# Altium schematic sheet HS-IO-Top.SchDoc
size A3; SheetNumber: 1; SheetTotal: 1
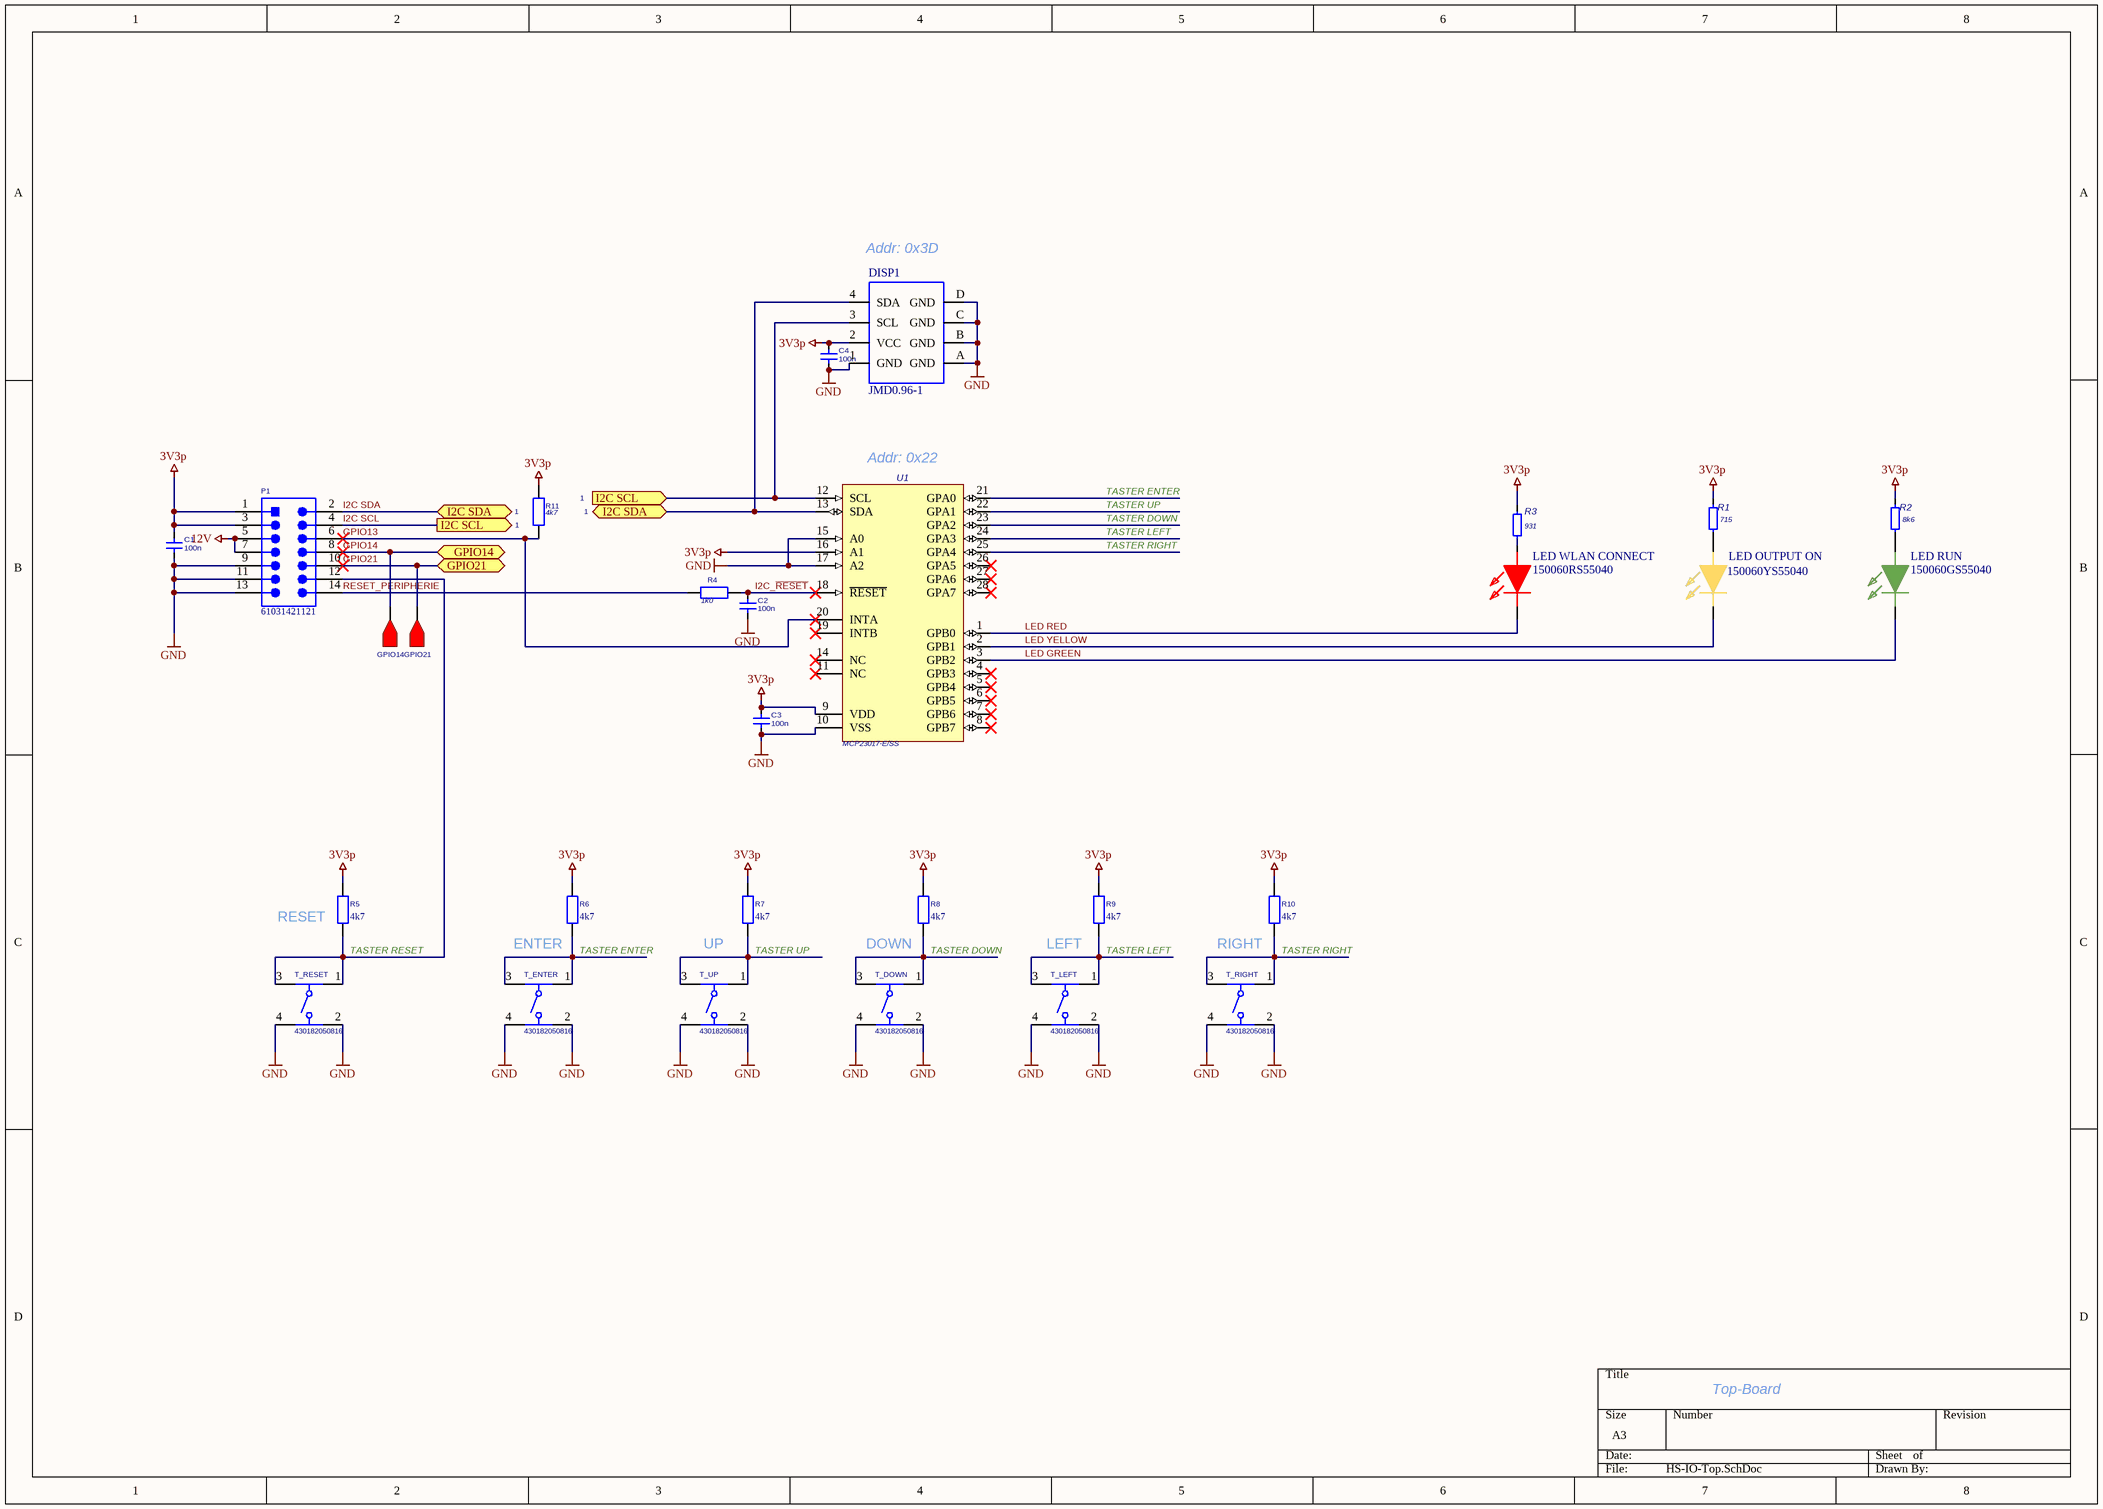
[diagram p0: HS-IO-Top.SchDoc]

## Parts
C1  100n  [CC1608-0603]
C2  100n  [CC1608-0603]
C3  100n  [CC1608-0603]
C4  100n  [CC1608-0603]
DISP1  JMD0.96-1  [JMD0.96-1-Footprint-1]
GPIO14  (no part)  [TESTPOINT]  (value not drawn)  (no BOM)
GPIO21  (no part)  [TESTPOINT]  (value not drawn)  (no BOM)
LED_OUTPUT_ON  150060YS55040  [LED_0603_Standard]
LED_RUN  150060GS55040  [LED_0603_Standard]
LED_WLAN_CONNECT  150060RS55040  [LED_0603_Standard]
P1  61031421121  [61031421121]
R1  715  [CC1608-0603]
R2  8k6  [CC1608-0603]
R3  931  [CC1608-0603]
R4  1k0  [CR1608-0603]
R5  4k7  [CR1608-0603]
R6  4k7  [CR1608-0603]
R7  4k7  [CR1608-0603]
R8  4k7  [CR1608-0603]
R9  4k7  [CR1608-0603]
R10  4k7  [CR1608-0603]
R11  4k7  [CR1608-0603]
T_DOWN  430182050816  [430182050816]
T_ENTER  430182050816  [430182050816]
T_LEFT  430182050816  [430182050816]
T_RESET  430182050816  [430182050816]
T_RIGHT  430182050816  [430182050816]
T_UP  430182050816  [430182050816]
U1  MCP23017-E/SS  [SSOP-SS28_M]

## Ports
GPIO14 (bidir), GPIO21 (bidir), I2C SCL (in, see 1), I2C SCL (out, see 1), I2C SDA (bidir, see 1)

## Nets
3V3p: C1.2 C3.2 C4.2 DISP1.2(VCC) P1.1 P1.3 R1.2 R2.2 R3.2 R5.2 R6.2 R7.2 R8.2 R9.2 R10.2 R11.2 U1.9(VDD) U1.16(A1)
12V: P1.5 P1.7
GND: C1.1 C2.1 C3.1 C4.1 DISP1.1(GND) DISP1.A(GND) DISP1.B(GND) DISP1.C(GND) DISP1.D(GND) P1.9 P1.11 P1.13 T_DOWN.2 T_DOWN.4 T_ENTER.2 T_ENTER.4 T_LEFT.2 T_LEFT.4 T_RESET.2 T_RESET.4 T_RIGHT.2 T_RIGHT.4 T_UP.2 T_UP.4 U1.10(VSS) U1.15(A0) U1.17(A2)
GPIO13: P1.6 R11.1 U1.20(INTA)
GPIO14: GPIO14.1 P1.8 ; port GPIO14
GPIO21: GPIO21.1 P1.10 ; port GPIO21
I2C SCL: DISP1.3(SCL) P1.4 U1.12(SCL) ; port I2C SCL
I2C SDA: DISP1.4(SDA) P1.2 U1.13(SDA) ; port I2C SDA
I2C_~{RESET}: C2.2 R4.1 U1.18(~{RESET})
LED GREEN: LED_RUN.1(K) U1.3(GPB2)
LED RED: LED_WLAN_CONNECT.1(K) U1.1(GPB0)
LED YELLOW: LED_OUTPUT_ON.1(K) U1.2(GPB1)
RESET_PERIPHERIE: P1.14 R4.2
TASTER DOWN: R8.1 T_DOWN.1 T_DOWN.3 U1.23(GPA2)
TASTER ENTER: R6.1 T_ENTER.1 T_ENTER.3 U1.21(GPA0)
TASTER LEFT: R9.1 T_LEFT.1 T_LEFT.3 U1.24(GPA3)
TASTER RESET: P1.12 R5.1 T_RESET.1 T_RESET.3
TASTER RIGHT: R10.1 T_RIGHT.1 T_RIGHT.3 U1.25(GPA4)
TASTER UP: R7.1 T_UP.1 T_UP.3 U1.22(GPA1)
NetLED_OUTPUT_ON_2: LED_OUTPUT_ON.2(A) R1.1
NetLED_RUN_2: LED_RUN.2(A) R2.1
NetLED_WLAN_CONNECT_2: LED_WLAN_CONNECT.2(A) R3.1

Not connected (* = marked no-connect by the designer): U1 4(GPB3)* 5(GPB4)* 6(GPB5)* 7(GPB6)* 8(GPB7)* 11(NC)* 14(NC)* 19(INTB)* 26(GPA5)* 27(GPA6)* 28(GPA7)*

## Notes on the sheet
- (near DISP1) Addr: 0x3D
- (near U1) Addr: 0x22
- (near R5) RESET
- ENTER
- UP
- DOWN
- LEFT
- RIGHT
- Top-Board

## Library data of the parts
C1-C4 = CMP-018-000010-5: SMD0603, X7R, 15%, 50V, 100nF; Manufacturer: KEMET; Manufacturer Part Number: C0603C104K5RAC7867; Kommentar: Kondensator aus mehreren Keramikschichten MLCC - SMD/SMT 50V 0.1uF X7R 0603 10%; Supplier Order Number: 80-C0603C104K5R7867; Supplier Price 100pcs: 0,022 €; Design Item ID: SMD_0603_100n_1; checked: checked; ComponentLink2URL: https://www.mouser.de/datasheet/2/447/KEM_C1002_X7R_SMD-3316098.pdf; Supplier: Mouser; ComponentLink1Description: Manufacturer Link; E01_Value_1: 100n; ComponentLink2Description: Datasheet; E08_Description: SMD0603, X7R, 15%, 50V, 100nF; ComponentLink1URL: https://www.kemet.com
DISP1 = CMP-00002-3: Monochrome 0.96" 128x64 I2C OLED Display (Breakout); Supplier: Mouser
GPIO14 GPIO21 = CMP-029-000001-1: Test Point; Manufacturer: (no part); Manufacturer Part Number: (no part); Supplier Order Number: (no part); Supplier Price 100pcs: (no part); Kommentar: (no part); Design Item ID: TESTPUNKT_1; E01_Value_1: (no part); checked: checked; Supplier: Mouser
LED_OUTPUT_ON = CMP-071-000002-1: LED yellow 0603; Manufacturer: Würth Elektronik; Design Item ID: 150060YS55040; Supplier Order Number: 710-150060YS55040; Manufacturer Part Number: 150060YS55040; Supplier Price 100pcs: 0,13€; Datasheet Link: http://katalog.we-online.de/led/datasheet/150060YS55040.pdf; Supplier: Mouser
LED_RUN = CMP-071-000000-1: LED green 0603; Manufacturer: Wurth Elektronik; Supplier Order Number: 710-150060GS55040; Manufacturer Part Number: 150060GS55040; Datasheet Link: http://katalog.we-online.de/led/datasheet/150060RS55040.pdf; Supplier Price 100pcs: 0,13€; Design Item ID: 150060GS55040; Supplier: Mouser
LED_WLAN_CONNECT = CMP-071-000001-1: LED red 0603; Manufacturer: Würth Elektronik; Manufacturer Part Number: 150060RS55040; Supplier Order Number: 710-150060RS55040; Datasheet Link: http://katalog.we-online.de/led/datasheet/150060RS55040.pdf; Design Item ID: 150060RS55040; Supplier Price 100pcs: 0,13€; Supplier: Mouser
P1 = CMP-067-000001-1: WR-PHD Pin Header, SMT, pitch 2.54mm, Dual Row, Vertical, 14p; Manufacturer: Wurth Elektronik; Design Item ID: 61031421121; Supplier Order Number: 710-61031421121; Datasheet Link: https://www.we-online.com/catalog/datasheet/61031421121.pdf; Manufacturer Part Number: 61031421121; Supplier: Mouser
R1 = CMP-073-000001-7: Resistor 715R 1% 0603; Manufacturer: Vishay / Dale; Manufacturer Part Number: CRCW0603715RFKEA; Design Item ID: s0603_715_1%; ComponentLink2URL: https://www.vishay.com/; E01_Value_1: 715; Supplier Order Number: 71-CRCW0603-715-E3; ComponentLink1URL: https://www.vishay.com/doc?20035; ComponentLink2Description: Manufacturer link; ComponentLink1Description: Datasheet; Supplier: Mouser
R2 = CMP-073-000002-7: Resistor 8k66 1% 0603; Manufacturer Part Number: CRCW06038K66FKEA; Manufacturer: Vishay / Dale; ComponentLink1Description: Datasheet; Design Item ID: s0603_8k66_1%; E01_Value_1: 8k66; ComponentLink1URL: https://www.vishay.com/doc?20035; Supplier Order Number: 71-CRCW0603-8.66K-E3; ComponentLink2URL: https://www.vishay.com/; ComponentLink2Description: Manufacturer; Supplier: Mouser
R3 = CMP-073-000000-7: Resistor 931R 1% 0603; Manufacturer: Vishay / Dale; Manufacturer Part Number: CRCW0603931RFKEA; Design Item ID: S0603_931_1%; ComponentLink2Description: Manufakturer Link; ComponentLink1Description: Datasheet; ComponentLink1URL: https://www.vishay.com/doc?20035; Supplier: Mouser; E01_Value_1: 931R; Supplier Order Number: 71-CRCW0603-931-E3; Supplier Price 100 Pcs: 0,009 €; ComponentLink2URL: https://www.vishay.com/
R4 = S0603_1k0_1_1: SMD0603, 0.1W, TK100, 1%, 1,0k, Metallfilm; Manufacturer: Vishay / Dale; Manufacturer Part Number: CRCW06031K00FKEAC; Kommentar: Dickfilmwiderstände - SMD 1/10Watt 1Kohms 1% Commercial Use; ComponentLink1Description: Manufacturer Link; ComponentLink2Description: Datasheet; ComponentLink2URL: https://www.vishay.com/docs/20035/dcrcwe3.pdf; Supplier: Mouser; Supplier Order Number: 71-CRCW06031K00FKEAC; Supplier Price 100pcs: 0,007 €; E01_Value_1: 1k0; ComponentLink1URL: https://www.vishay.com/; E08_Description: SMD0603, 0.1W, TK100, 1%, 1,0k, Metallfilm
R5-R10 = CMP-027-000017-2: SMD0603, 0.1W, TK100, 1%, 4,7k, Metallfilm; Manufacturer Part Number: CRCW06034K70FKEAC; Manufacturer: Vishay / Dale; Kommentar: Dickfilmwiderstände - SMD 1/10Watt 4.7Kohms 1% Commercial Use; Design Item ID: S0603_4k7_1; Supplier Order Number: 71-CRCW06034K70FKEAC; Supplier Price 100pcs: 0,007 €; ComponentLink2URL: https://www.vishay.com/docs/20035/dcrcwe3.pdf; E08_Description: SMD0603, 0.1W, TK100, 1%, 4,7k, Metallfilm; E01_Value_1: 4k7; ComponentLink1Description: Manufacturer Link; checked: checked; ComponentLink1URL: https://www.vishay.com/; ComponentLink2Description: Datasheet; Supplier: Mouser
R11 = CMP-027-000017-2: SMD0603, 0.1W, TK100, 1%, 4,7k, Metallfilm; Manufacturer: Vishay / Dale; Manufacturer Part Number: CRCW06034K70FKEAC; Kommentar: Dickfilmwiderstände - SMD 1/10Watt 4.7Kohms 1% Commercial Use; Supplier Order Number: 71-CRCW06034K70FKEAC; E01_Value_1: 4k7; Design Item ID: S0603_4k7_1; ComponentLink1URL: https://www.vishay.com/; checked: checked; ComponentLink1Description: Manufacturer Link; ComponentLink2URL: https://www.vishay.com/docs/20035/dcrcwe3.pdf; ComponentLink2Description: Datasheet; Supplier Price 100pcs: 0,007 €; E08_Description: SMD0603, 0.1W, TK100, 1%, 4,7k, Metallfilm; Supplier: Mouser
T_DOWN T_ENTER T_LEFT T_RESET T_RIGHT T_UP = CMP-074-000000-1: WS-TASV SMT Tact Switch, 6x6x5mm, 160gf; Manufacturer: Wurth Elektronik; Manufacturer Part Number: 430182050816; Design Item ID: 430182050816; Datasheet Link: https://www.we-online.com/catalog/datasheet/430182050816.pdf; Supplier Order Number: 710-430182050816; Supplier: Mouser
U1 = CMP-015-000011-1: 16-Bit I/O Expander with Serial Interface, 28-Pin SSOP, Extended Temperature; Manufacturer: Microchip; Kommentar: Schnittstelle - I/O-Erweiterer 16bit Input/Output Exp I2C interface; ComponentLink1URL: http://www.microchip.com/; E01_Value_1: MCP23017-E/SS; ComponentLink2Description: Datasheet; Manufacturer Part Number: MCP23017-E/SS; Design Item ID: CMP-0186-00176-2; ComponentLink2URL: http://ww1.microchip.com/downloads/en/DeviceDoc/21952b.pdf; ComponentLink1Description: Manufacturer Link; Supplier Price 100pcs: 1,19€; Supplier Order Number: 579-MCP23017-E/SS; Supplier: Mouser